# EAGLE schematic schema (EAGLE 7.6.0)
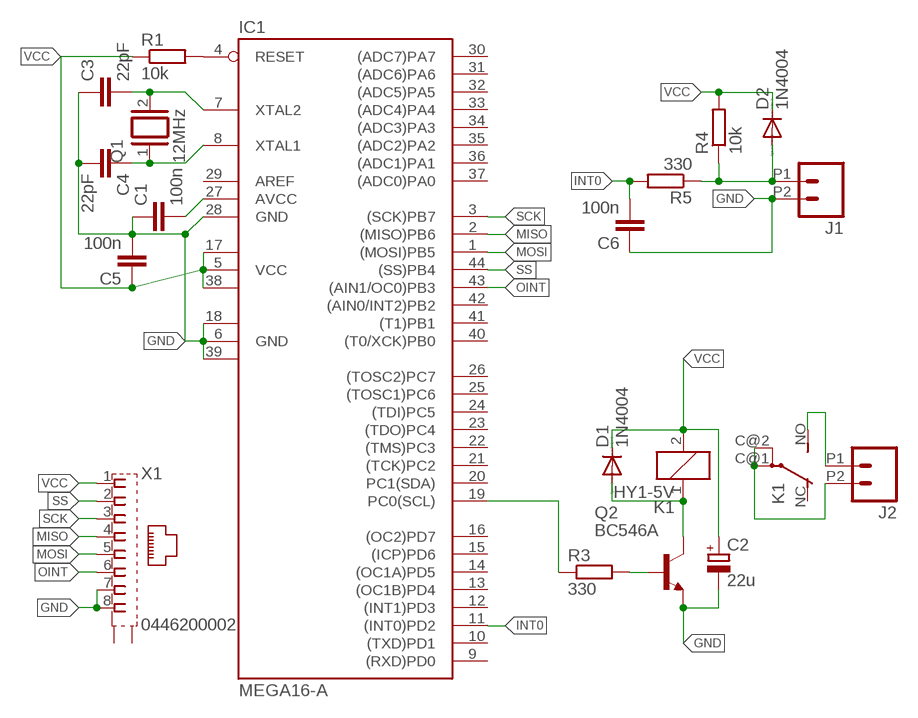
[diagram p0: schematic, sheet 1]

## Parts
C1  100n  C-EU050-024X044  [C050-024X044]
C2  22u  CPOL-EUE2.5-6  [E2,5-6]
C3  22pF  C-EU050-024X044  [C050-024X044]
C4  22pF  C-EU050-024X044  [C050-024X044]
C5  100n  C-EU050-024X044  [C050-024X044]
C6  100n  C-EU050-024X044  [C050-024X044]
D1  1N4004  [DO41-10]
D2  1N4004  [DO41-10]
IC1  MEGA16-A  [TQFP44]
J1  M022.54MM_SCREWTERM  [1X02_2.54_SCREWTERM]
J2  M022.54MM_SCREWTERM  [1X02_2.54_SCREWTERM]
K1  HY1-5V  [HY]
Q1  12MHz  XTAL/S  [QS]
Q2  BC546A  [TO92-EBC]
R1  10k  R-EU_0204/7  [0204/7]
R3  330  R-EU_0204/7  [0204/7]
R4  10k  R-EU_0204/7  [0204/7]
R5  330  R-EU_0204/7  [0204/7]
X1  0446200002  [0446200002]

## Nets
GND: C1.1 C2.- C3.1 C4.2 C5.2 C6.1 IC1.6(GND) IC1.18(GND1) IC1.28(GND) IC1.39(GND2) J1.P2 Q2.E X1.7 X1.8
INT0: C6.2 IC1.11((INT0)PD2) R5.2
MISO: IC1.2((MISO)PB6) X1.4
MOSI: IC1.1((MOSI)PB5) X1.5
N$1: C3.2 IC1.7(XTAL2) Q1.2
N$2: C4.1 IC1.8(XTAL1) Q1.1
N$3: D1.A K1.1 Q2.C
N$4: Q2.B R3.2
N$5: J2.P2 K1.C@1(2:P) K1.C@2(2:P)
N$6: C1.2 IC1.27(AVCC)
N$7: IC1.4(RESET) R1.2
N$8: J2.P1 K1.NO(2:S)
N$10: IC1.19(PC0(SCL)) R3.1
N$11: D2.A J1.P1 R4.1 R5.1
OINT: IC1.43((AIN1/OC0)PB3) X1.6
SCK: IC1.3((SCK)PB7) X1.3
SS: IC1.44((SS)PB4) X1.2
VCC: C2.+ C5.1 D1.C D2.C IC1.5(VCC) IC1.17(VCC1) IC1.38(VCC2) K1.2 R1.1 R4.2 X1.1
Unconnected: IC1.9((RXD)PD0) IC1.10((TXD)PD1) IC1.12((INT1)PD3) IC1.13((OC1B)PD4) IC1.14((OC1A)PD5) IC1.15((ICP)PD6) IC1.16((OC2)PD7) IC1.20(PC1(SDA)) IC1.21((TCK)PC2) IC1.22((TMS)PC3) IC1.23((TDO)PC4) IC1.24((TDI)PC5) IC1.25((TOSC1)PC6) IC1.26((TOSC2)PC7) IC1.29(AREF) IC1.30((ADC7)PA7) IC1.31((ADC6)PA6) IC1.32((ADC5)PA5) IC1.33((ADC4)PA4) IC1.34((ADC3)PA3) IC1.35((ADC2)PA2) IC1.36((ADC1)PA1) IC1.37((ADC0)PA0) IC1.40((T0/XCK)PB0) IC1.41((T1)PB1) IC1.42((AIN0/INT2)PB2) K1.NC(2:O) X1.S@1(S1) X1.S@2(S2)

## Library data of the parts
C1 C3-C6 = rcl:C-EU: CAPACITOR, European symbol
C2 = resistor:CPOL-EU: POLARIZED CAPACITOR, European symbol
D1 D2 = diode:1N4004: DIODE general purpose rectifier, 1 A
IC1 = atmel:MEGA16: MICROCONTROLLER 16 Kbytes FLASH 1 kbytes SRAM 512 bytes EEPROM USART 8-channel 10 bit ADC Source: avr.lbr; MPN: ATMEGA16-16AU; OC_FARNELL: 9171134; OC_NEWARK: 96K6515
J1 J2 = SparkFun-Connectors:M02: Standard 2-pin 0.1" header. Use with - straight break away headers ( PRT-00116) - right angle break away headers (PRT-00553) - swiss pins (PRT-00743) - machine pins (PRT-00117) - female headers (PRT-00115) Molex polarized connector foot print use with: PRT-08233 with associated crimp pins and housings. 2.54_SCREWTERM for use with PRT-10571. 3.5mm Screw Terminal footprints for PRT-08084 5mm Screw Terminal footprints for use with PRT-08432
K1 = relay:HY1*: Non-polarized 1 Form C Relay NAiS Source: http://www.mew-europe.com/.. en_ds_61012_0000.pdf; MF: AROMAT/ MATSUSHITA; MPN: HY1-5V; OC_FARNELL: unknown; OC_NEWARK: 10C6692
Q1 = special:XTAL/S: CRYSTAL
Q2 = transistor-npn:BC546*: NPN Transistor
R1 R3-R5 = resistor:R-EU_: RESISTOR, European symbol
X1 = con-molex:0446200002: RJ-45 INVERTED MODULAR JACK ASSEMBLY WITH RJ-11 KEEPOUT FEATURE Source: Data sheet <http://www.farnell.com/datasheets/73207.pdf> MOLEX 0446200002 BUCHSE, RJ45, GESCHIRMT Source: Farnell <http://de.farnell.com/molex/0446200002/buchse-rj45-geschirmt/dp/9251910?ost=9251910>; MF: MOLEX; MPN: 0446200002; OC_FARNELL: 9251910